# Altium project RPI Arduino Shied.PrjPcb
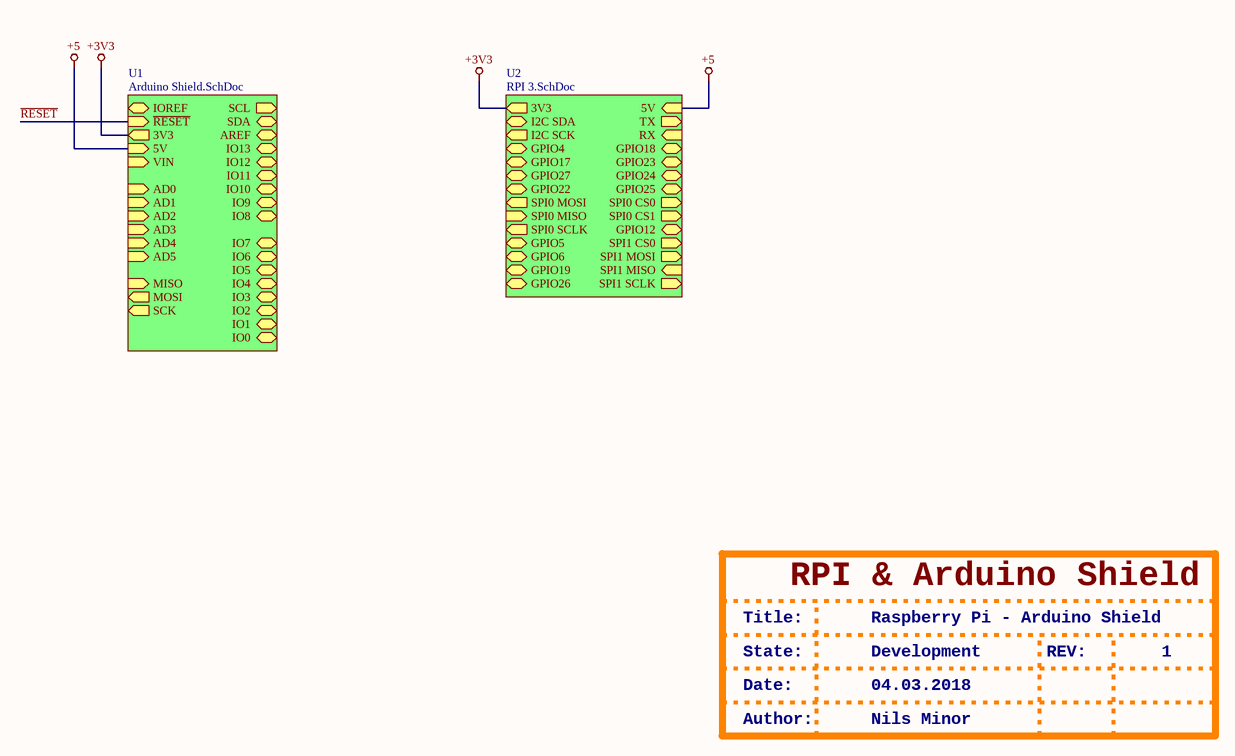
[diagram p0: RPI Arduino Shied Main.SchDoc]
mProjectAuthor: Nils Minor; mProjectName: RPI BOARD; mProjectRevision: 0; mProjectVersion: 1
3 sheets, 6 parts. Net scope: hierarchical (ports join the sheet entries above them; power ports are global).
Board file: RPI Arduino Shied.PcbDoc
Sheets:
  RPI Arduino Shied Main.SchDoc
    U1 = Arduino Shield.SchDoc
    U2 = RPI 3.SchDoc

## Sheet RPI Arduino Shied Main.SchDoc
size A4

### Sub-sheets
U1 = Arduino Shield.SchDoc: IOREF (bidir), ~{RESET} (in), 3V3 (out), 5V (in), VIN (in), AD0 (in), AD1 (in), AD2 (in), AD3 (in), AD4 (in), AD5 (in), IO0 (bidir), IO7 (bidir), IO6 (bidir), IO5 (bidir), IO4 (bidir), IO3 (bidir), IO2 (bidir), IO1 (bidir), IO8 (bidir), AREF (bidir), IO13 (bidir), IO12 (bidir), IO11 (bidir), IO10 (bidir), IO9 (bidir), SDA (bidir), SCL (out), MISO (in), SCK (out), MOSI (out)
U2 = RPI 3.SchDoc: I2C SDA (bidir), I2C SCK (out), GPIO4 (bidir), GPIO17 (bidir), GPIO27 (bidir), GPIO22 (bidir), SPI0 MOSI (out), SPI0 MISO (in), SPI0 SCLK (out), GPIO26 (bidir), GPIO19 (bidir), GPIO6 (bidir), GPIO5 (bidir), SPI1 MISO (in), SPI1 MOSI (out), SPI0 CS1 (out), SPI1 SCLK (out), SPI0 CS0 (out), RX (in), TX (out), GPIO23 (bidir), GPIO24 (bidir), GPIO25 (bidir), GPIO12 (bidir), SPI1 CS0 (out), 5V (in), 3V3 (out), GPIO18 (bidir)

### Nets
+3V3: sheet U1/3V3, sheet U2/3V3
+5: sheet U1/5V, sheet U2/5V  [project net 5V]

### Notes on the sheet
- RPI & Arduino Shield
- Title:
- State:
- Raspberry Pi - Arduino Shield
- Development
- REV:
- 1
- Date:
- Author:
- 04.03.2018
- Nils Minor

## Sheet Arduino Shield.SchDoc
size A4
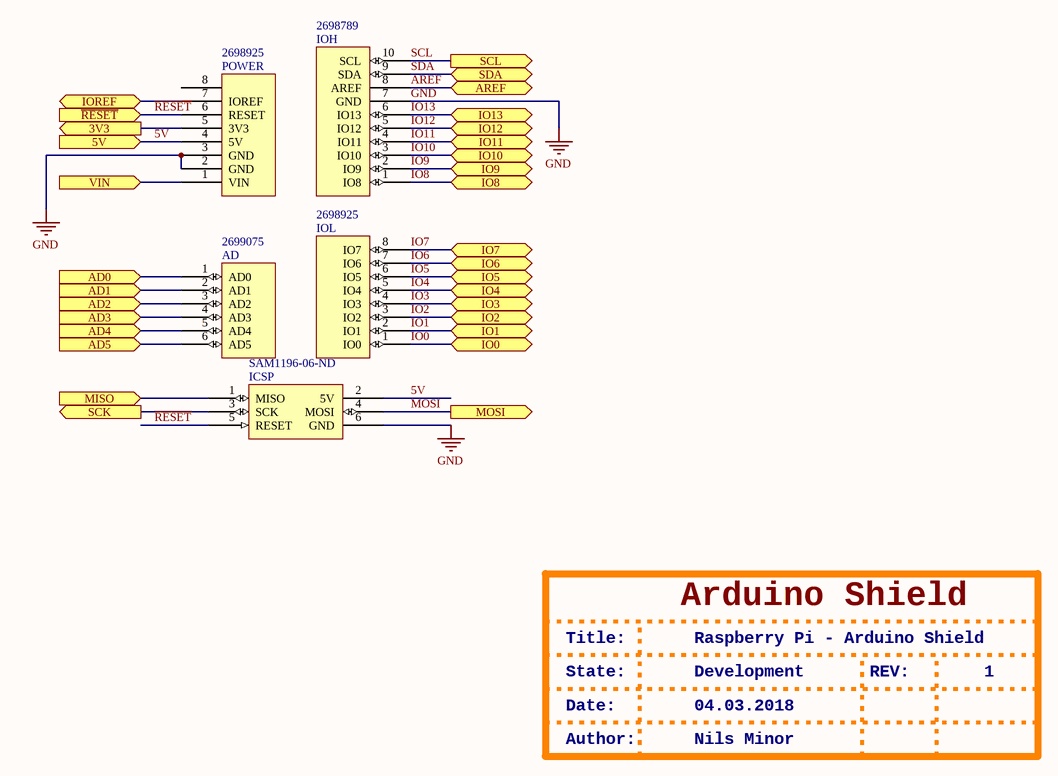
[diagram p1: Arduino Shield.SchDoc]

### Parts
AD  Supplier Part Number 4: 2699075  [Header 6x1 8.5mm]  (hidden comment: AD)
ICSP  Supplier Part Number 5: SAM1196-06-ND  [ICSP]  (hidden comment: ICSP)
IOH  Supplier Part Number 3: 2698789  [Header 10x1 8.5mm]  (hidden comment: IOH)
IOL  Supplier Part Number 4: 2698925  [Header 8x1 8.5mm]  (hidden comment: IOL)
POWER  Supplier Part Number 4: 2698925  [Header 8x1 8.5mm]  (hidden comment: POWER_UNO)

### Ports
3V3 (out), 5V (in), AD0 (in), AD1 (in), AD2 (in), AD3 (in), AD4 (in), AD5 (in), AREF (bidir), IO0 (bidir), IO1 (bidir), IO2 (bidir), IO3 (bidir), IO4 (bidir), IO5 (bidir), IO6 (bidir), IO7 (bidir), IO8 (bidir), IO9 (bidir), IO10 (bidir), IO11 (bidir), IO12 (bidir), IO13 (bidir), IOREF (bidir), MISO (in), MOSI (out), SCK (out), SCL (out), SDA (bidir), VIN (in), ~{RESET} (in)

### Nets
5V: ICSP.2(5V) POWER.4(5V) ; port 5V
+3V3: POWER.5(3V3) ; port 3V3
GND: ICSP.6(GND) IOH.7(GND) POWER.2(GND) POWER.3(GND)
AREF: IOH.8(AREF) ; port AREF
IO0: IOL.1(IO0) ; port IO0
IO1: IOL.2(IO1) ; port IO1
IO2: IOL.3(IO2) ; port IO2
IO3: IOL.4(IO3) ; port IO3
IO4: IOL.5(IO4) ; port IO4
IO5: IOL.6(IO5) ; port IO5
IO6: IOL.7(IO6) ; port IO6
IO7: IOL.8(IO7) ; port IO7
IO8: IOH.1(IO8) ; port IO8
IO9: IOH.2(IO9) ; port IO9
IO10: IOH.3(IO10) ; port IO10
IO11: IOH.4(IO11) ; port IO11
IO12: IOH.5(IO12) ; port IO12
IO13: IOH.6(IO13) ; port IO13
MOSI: ICSP.4(MOSI) ; port MOSI
~{RESET}: ICSP.5(RESET) POWER.6(RESET) ; port ~{RESET}
SCL: IOH.10(SCL) ; port SCL
SDA: IOH.9(SDA) ; port SDA
NetAD_1: AD.1(AD0) ; port AD0
NetAD_2: AD.2(AD1) ; port AD1
NetAD_3: AD.3(AD2) ; port AD2
NetAD_4: AD.4(AD3) ; port AD3
NetAD_5: AD.5(AD4) ; port AD4
NetAD_6: AD.6(AD5) ; port AD5
NetICSP_1: ICSP.1(MISO) ; port MISO
NetICSP_3: ICSP.3(SCK) ; port SCK
NetPOWER_1: POWER.1(VIN) ; port VIN
NetPOWER_7: POWER.7(IOREF) ; port IOREF

Not connected (* = marked no-connect by the designer): POWER 8

### Notes on the sheet
- Arduino Shield
- Title:
- State:
- Raspberry Pi - Arduino Shield
- Development
- REV:
- 1
- Date:
- Author:
- 04.03.2018
- Nils Minor

### Library data of the parts
AD = AD: Supplier 1: Arrow; Supplier Part Number 1: 2699089; Supplier 2: Digi-Key; Supplier Part Number 2: SAM1198-06-ND; Supplier 3: Arrow; Supplier Part Number 3: 2699088; Supplier 4: Arrow
ICSP = ICSP: Supplier 1: Arrow; Supplier Part Number 1: 2699117; Supplier 2: Arrow; Supplier Part Number 2: 2699116; Supplier 3: Digi-Key; Supplier Part Number 3: SAM1185-06-ND; Supplier 4: Arrow; Supplier Part Number 4: 2699091; Supplier 5: Digi-Key
IOH = IOH: Supplier 1: Arrow; Supplier Part Number 1: 2698803S4475693N1004; Supplier 2: Digi-Key; Supplier Part Number 2: SAM1198-10-ND; Supplier 3: Arrow
IOL = IOL: Supplier 1: Digi-Key; Supplier Part Number 1: SAM1198-08-ND; Supplier 2: Arrow; Supplier Part Number 2: 2698939; Supplier 3: Arrow; Supplier Part Number 3: 2698940; Supplier 4: Arrow
POWER = POWER_UNO: Supplier 1: Digi-Key; Supplier Part Number 1: SAM1198-08-ND; Supplier 2: Arrow; Supplier Part Number 2: 2698939; Supplier 3: Arrow; Supplier Part Number 3: 2698940; Supplier 4: Arrow

## Sheet RPI 3.SchDoc
size A4; SheetNumber: 1; SheetTotal: 1
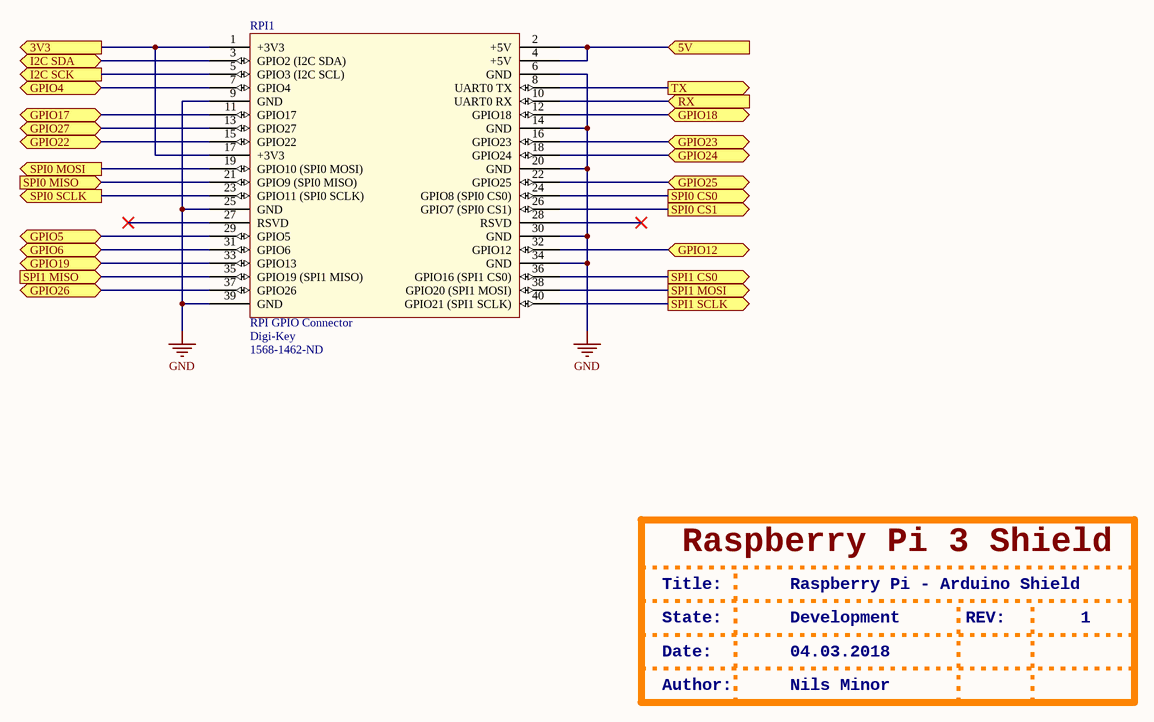
[diagram p2: RPI 3.SchDoc]

### Parts
RPI1  RPI GPIO Connector  Supplier 1: Digi-Key  Supplier Part Number 1: 1568-1462-ND  [rpi]

### Ports
3V3 (out), 5V (in), GPIO4 (bidir), GPIO5 (bidir), GPIO6 (bidir), GPIO12 (bidir), GPIO17 (bidir), GPIO18 (bidir), GPIO19 (bidir), GPIO22 (bidir), GPIO23 (bidir), GPIO24 (bidir), GPIO25 (bidir), GPIO26 (bidir), GPIO27 (bidir), I2C SCK (out), I2C SDA (bidir), RX (in), SPI0 CS0 (out), SPI0 CS1 (out), SPI0 MISO (in), SPI0 MOSI (out), SPI0 SCLK (out), SPI1 CS0 (out), SPI1 MISO (in), SPI1 MOSI (out), SPI1 SCLK (out), TX (out)

### Nets
5V: RPI1.2(+5V) RPI1.4(+5V) ; port 5V
+3V3: RPI1.1(+3V3) RPI1.17(+3V3) ; port 3V3
GND: RPI1.6(GND) RPI1.9(GND) RPI1.14(GND) RPI1.20(GND) RPI1.25(GND) RPI1.30(GND) RPI1.34(GND) RPI1.39(GND)
NetRPI1_3: RPI1.3(GPIO2_(I2C_SDA)) ; port I2C SDA
NetRPI1_5: RPI1.5(GPIO3_(I2C_SCL)) ; port I2C SCK
NetRPI1_7: RPI1.7(GPIO4) ; port GPIO4
NetRPI1_8: RPI1.8(UART0_TX) ; port TX
NetRPI1_10: RPI1.10(UART0_RX) ; port RX
NetRPI1_11: RPI1.11(GPIO17) ; port GPIO17
NetRPI1_12: RPI1.12(GPIO18) ; port GPIO18
NetRPI1_13: RPI1.13(GPIO27) ; port GPIO27
NetRPI1_15: RPI1.15(GPIO22) ; port GPIO22
NetRPI1_16: RPI1.16(GPIO23) ; port GPIO23
NetRPI1_18: RPI1.18(GPIO24) ; port GPIO24
NetRPI1_19: RPI1.19(GPIO10_(SPI0_MOSI)) ; port SPI0 MOSI
NetRPI1_21: RPI1.21(GPIO9_(SPI0_MISO)) ; port SPI0 MISO
NetRPI1_22: RPI1.22(GPIO25) ; port GPIO25
NetRPI1_23: RPI1.23(GPIO11_(SPI0_SCLK)) ; port SPI0 SCLK
NetRPI1_24: RPI1.24(GPIO8_(SPI0_CS0)) ; port SPI0 CS0
NetRPI1_26: RPI1.26(GPIO7_(SPI0_CS1)) ; port SPI0 CS1
NetRPI1_29: RPI1.29(GPIO5) ; port GPIO5
NetRPI1_31: RPI1.31(GPIO6) ; port GPIO6
NetRPI1_32: RPI1.32(GPIO12) ; port GPIO12
NetRPI1_33: RPI1.33(GPIO13) ; port GPIO19
NetRPI1_35: RPI1.35(GPIO19_(SPI1_MISO)) ; port SPI1 MISO
NetRPI1_36: RPI1.36(GPIO16_(SPI1_CS0)) ; port SPI1 CS0
NetRPI1_37: RPI1.37(GPIO26) ; port GPIO26
NetRPI1_38: RPI1.38(GPIO20_(SPI1_MOSI)) ; port SPI1 MOSI
NetRPI1_40: RPI1.40(GPIO21_(SPI1_SCLK)) ; port SPI1 SCLK

Not connected (* = marked no-connect by the designer): RPI1 27(RSVD)* 28(RSVD)*

### Notes on the sheet
- Raspberry Pi 3 Shield
- Title:
- State:
- Raspberry Pi - Arduino Shield
- Development
- REV:
- 1
- Date:
- Author:
- 04.03.2018
- Nils Minor

### Library data of the parts
RPI1 = rpi connector: GPIO Header for Raspberry Pi A+/B+/Pi 2/Pi 3 - 2x20; Manufacturer: SparkFun Electronics; Manufacturer Part Number: PRT-14017; Nils Minor: author; nilsminor@web.de: mail; RoHS: RoHS Compliant; Category: Development Boards, Kits, Programmers; Stock 1: 150; Pricing 1: 1=1.84 (EUR); Part Status: Active; Accessory Type: Connector; For Use With/Related Products: Raspberry Pi; ComponentLink1URL: https://cdn.sparkfun.com/datasheets/Dev/RaspberryPi/12313.pdf; ComponentLink1Description: https://cdn.sparkfun.com/datasheets/Dev/RaspberryPi/12313.pdf

## Nets that join several sheets
5V: Arduino Shield (ICSP.2 POWER.4), RPI 3 (RPI1.2 RPI1.4)
+3V3: Arduino Shield (POWER.5), RPI 3 (RPI1.1 RPI1.17)
GND: Arduino Shield (ICSP.6 IOH.7 POWER.2 POWER.3), RPI 3 (8 pins)

## Assembly variants
default: all parts fitted